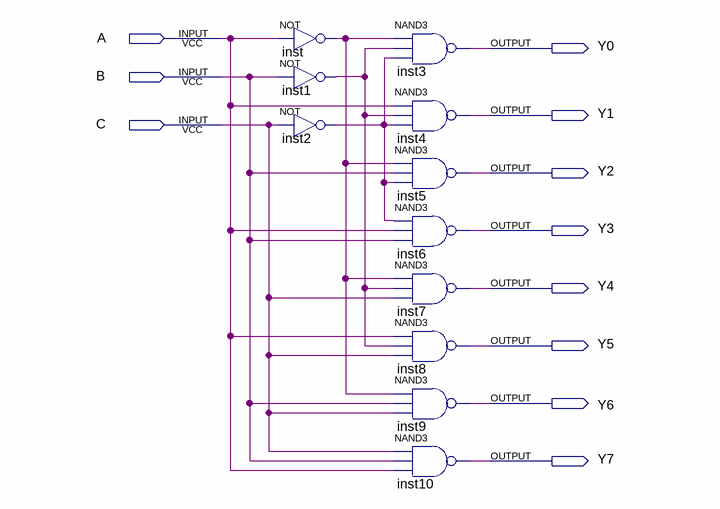
[diagram p0: schematic sheet]
// Quartus schematic 3x8_decoder.bdf as structural Verilog: 11 symbols, 11 pins
module \3x8_decoder  (
  input  A,
  input  B,
  input  C,
  output Y0,
  output Y1,
  output Y2,
  output Y3,
  output Y4,
  output Y5,
  output Y6,
  output Y7
);

  wire inst1_out, inst2_out, inst_out;

  not inst (inst_out, A);
  not inst1 (inst1_out, B);
  not inst2 (inst2_out, C);
  nand inst3 (Y0, inst_out, inst1_out, inst2_out);
  nand inst4 (Y1, A, inst1_out, inst2_out);
  nand inst5 (Y2, inst_out, B, inst2_out);
  nand inst6 (Y3, inst2_out, A, B);
  nand inst7 (Y4, inst_out, inst1_out, C);
  nand inst8 (Y5, A, inst1_out, C);
  nand inst9 (Y6, inst_out, B, C);
  nand inst10 (Y7, C, B, A);
endmodule
